# Altium schematic sheet VibrationMotor.SchDoc
size A4; SheetNumber: 5; SheetTotal: 5
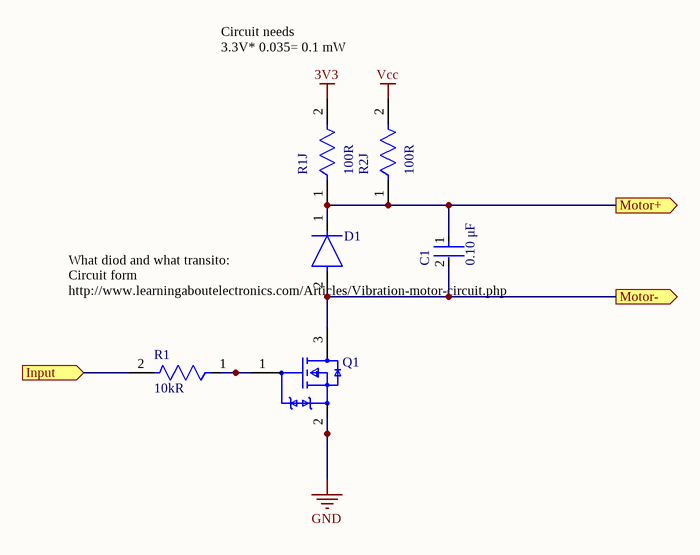
[diagram p0: VibrationMotor.SchDoc]

## Parts
C1  value 0.10 μF  [FP-C0603C-CF-MFG]  (hidden comment: C0603C104K5RACTU)
D1  LS4448GS08  [FP-6_560-5006_01-4-MFG]  (value not drawn)
Q1  DMG2302UK-7  [FP-SOT23-MFG]  (value not drawn)
R1  Resistance: 10kR  [FP-ESR03-MFG]  (hidden comment: ESR03EZPJ101)
R1J  Resistance: 100R  [FP-ESR03-MFG]  (hidden comment: ESR03EZPJ101)
R2J  Resistance: 100R  [FP-ESR03-MFG]  (hidden comment: ESR03EZPJ101)

## Ports
Input (in), Motor+ (out), Motor- (out)

## Nets
3V3: R1J.2
GND: Q1.2(S)
Vcc: R2J.2
Input: R1.2 ; port Input
Motor+: C1.1 D1.1(C) R1J.1 R2J.1 ; port Motor+
Motor-: C1.2 D1.2(A) Q1.3(D) ; port Motor-
NetQ1_1: Q1.1(G) R1.1

## Notes on the sheet
- Circuit needs
  3.3V* 0.035= 0.1 mW
  With Vibro Motor
  https://www.distrelec.ch/de/vibrationsmotor-seeed-studio-316040004/p/30214484
- What diod and what transito:
  Circuit form http://www.learningaboutelectronics.com/Articles/Vibration-motor-circuit.php

## Library data of the parts
C1 = CMP-2006-03061-2: CAP CER 0.1UF 50V X7R 0603; Manufacturer: KEMET; Tolerance: 0.1; Description: C0603 0.10 μF X7R 30ppm/°C 10.00% 50 V; Temperature Coefficient: 30ppm/°C; Material: Ceramic; Automotive Grade: Grade 1; Temperature: -55°C to +125°C; RoHS: TRUE; Temperature Range High: +125°C; Lead Free: Yes; Octopart: https://octopart.com/c0603c104k5ractu-kemet-139244; Digikey Description: CAP CER 0.1UF 50V X7R 0603; Category: Cap; Package: C0603C-CF; ComponentLink2Description: Datasheet; Temperature Range Low: -55°C; Device Class L1: Passive Components; Voltage Rating: 50 V; Automotive: Yes; Device Class L3: Ceramic Capacitors; ComponentLink2URL: https://api.kemet.com/component-edge/download/datasheet/C0603C100J5GACAUTO.pdf; Capacitance: 0.10 μF; Device Class L2: Capacitors; Manufacturer Part Number: C0603C104K5RACTU; Temperature Characteristic: X7R; Height: 0.87mm
D1 = CMP-02540-000047-1: DIODE GEN PURP 100V 300MA SOD80; Manufacturer: Vishay; Max Junction Temp: +175°C; Reverse Voltage: 75V; Peak Reverse Current: 5uA; Automotive Grade: Grade 0; Value: 4pF; Max Surge Forward Current: 2A; Category: Diode; Forward Current: 300mA; ComponentLink2Description: Datasheet; Lead Free: Yes; Automotive: Yes; Device Class L1: Discrete Semiconductors; Temperature: to +175°C; Package: 6.560-5006.01-4; Max Repetitive Reverse Voltage: 100V; RoHS: TRUE; Manufacturer Part Number: LS4448GS08; ComponentLink2URL: http://www.vishay.com/docs/85561/ls4148.pdf; Device Class L3: Rectifier Diodes; Capacitance: 4pF; Octopart: https://octopart.com/ls4448gs08-vishay-55433966; Digikey Description: DIODE GEN PURP 100V 300MA SOD80; Device Class L2: Diodes; Height: 1.6mm; Mouser Description: Diodes - General Purpose, Power, Switching 100V Io/150mA 2.0 Amp IFSM; Temperature Range High: +175°C
Q1 = CMP-12801-000001-1: MOSFET N-CH 20V 2.8A SOT23; Manufacturer: Diodes Inc.; Reverse Recovery Time: 5.3ns; Gate Charge At Vgs: 2.8nC @ 10V; Turn On Delay Time: 0.6ns; Pulse Drain Current: 12A; Max Forward Diode Voltage: 1.2V; Reverse Recovery Charge: 0.5nC; Automotive Grade: Grade 0; Threshold Vgs Min: 0.3V; Number Of N Channels: 1; Standoff Height: 0.013mm; Typ Forward Diode Voltage: 0.7V; Drain To Source Resistance: 61mΩ; Rthja Max: 192°C/W; Max Junction Temp: +150°C; Input Capacitace At Vds: 130pF @ 10V; Threshold Vgs Max: 1V; Turn Off Delay Time: 4.2ns; Depletion Mode: False; Gate To Source Voltage: 12V; Power Dissipation: 0.66W; Device Class L1: Discrete Semiconductors; Footprint Url: https://www.diodes.com/assets/Package-Files/SOT23.pdf; Lead Free: Yes; Manufacturer Part Number: DMG2302UK-7; Temperature Range High: +150°C; Drain To Source Voltage: 20V; Category: Trans; Digikey Description: MOSFET N-CH 20V 2.8A SOT23; RoHS: TRUE; Device Class L2: Transistors; Height: 1.1mm; Automotive: Yes; Package: SOT23; Drain To Source Breakdown Voltage: 20V; Continuous Drain Current: 2.8A; ComponentLink2Description: Datasheet; Device Class L3: MOSFETs; Octopart: https://octopart.com/dmg2302uk-7-diodes+inc.-73850182; Temperature Range Low: -55°C; Temperature: -55°C to +150°C; Number Of Channels: 1; ComponentLink2URL: https://www.diodes.com/assets/Datasheets/DMG2302UK.pdf
R1 R1J R2J = CMP-08839-000028-1: 100Ω ±5% 0.25W 0603 Anti-Surge Chip Resistor AEC-Q200; Power Rating: 200mW; Temperature Coefficient: 200ppm/°C; Max Power Dissipation: 250mW; Case Code (Imperial): 0603; Number of Terminations: 2; RoHS Compliant: Yes; Series: ESR; Lead Free: Lead Free; Features: Automotive AEC-Q200; Case/Package: 0603; Tolerance: 5%; Min Operating Temperature: -55°C; Size Code: 0603; Case Code (Metric): 1608; Max Operating Temperature: 155°C; Packaging: Tape and Reel